# EasyEDA Pro project md2.PcbDoc-V1.0-20250619.eprj

# Board md2.PcbDoc-V1.0-20250619
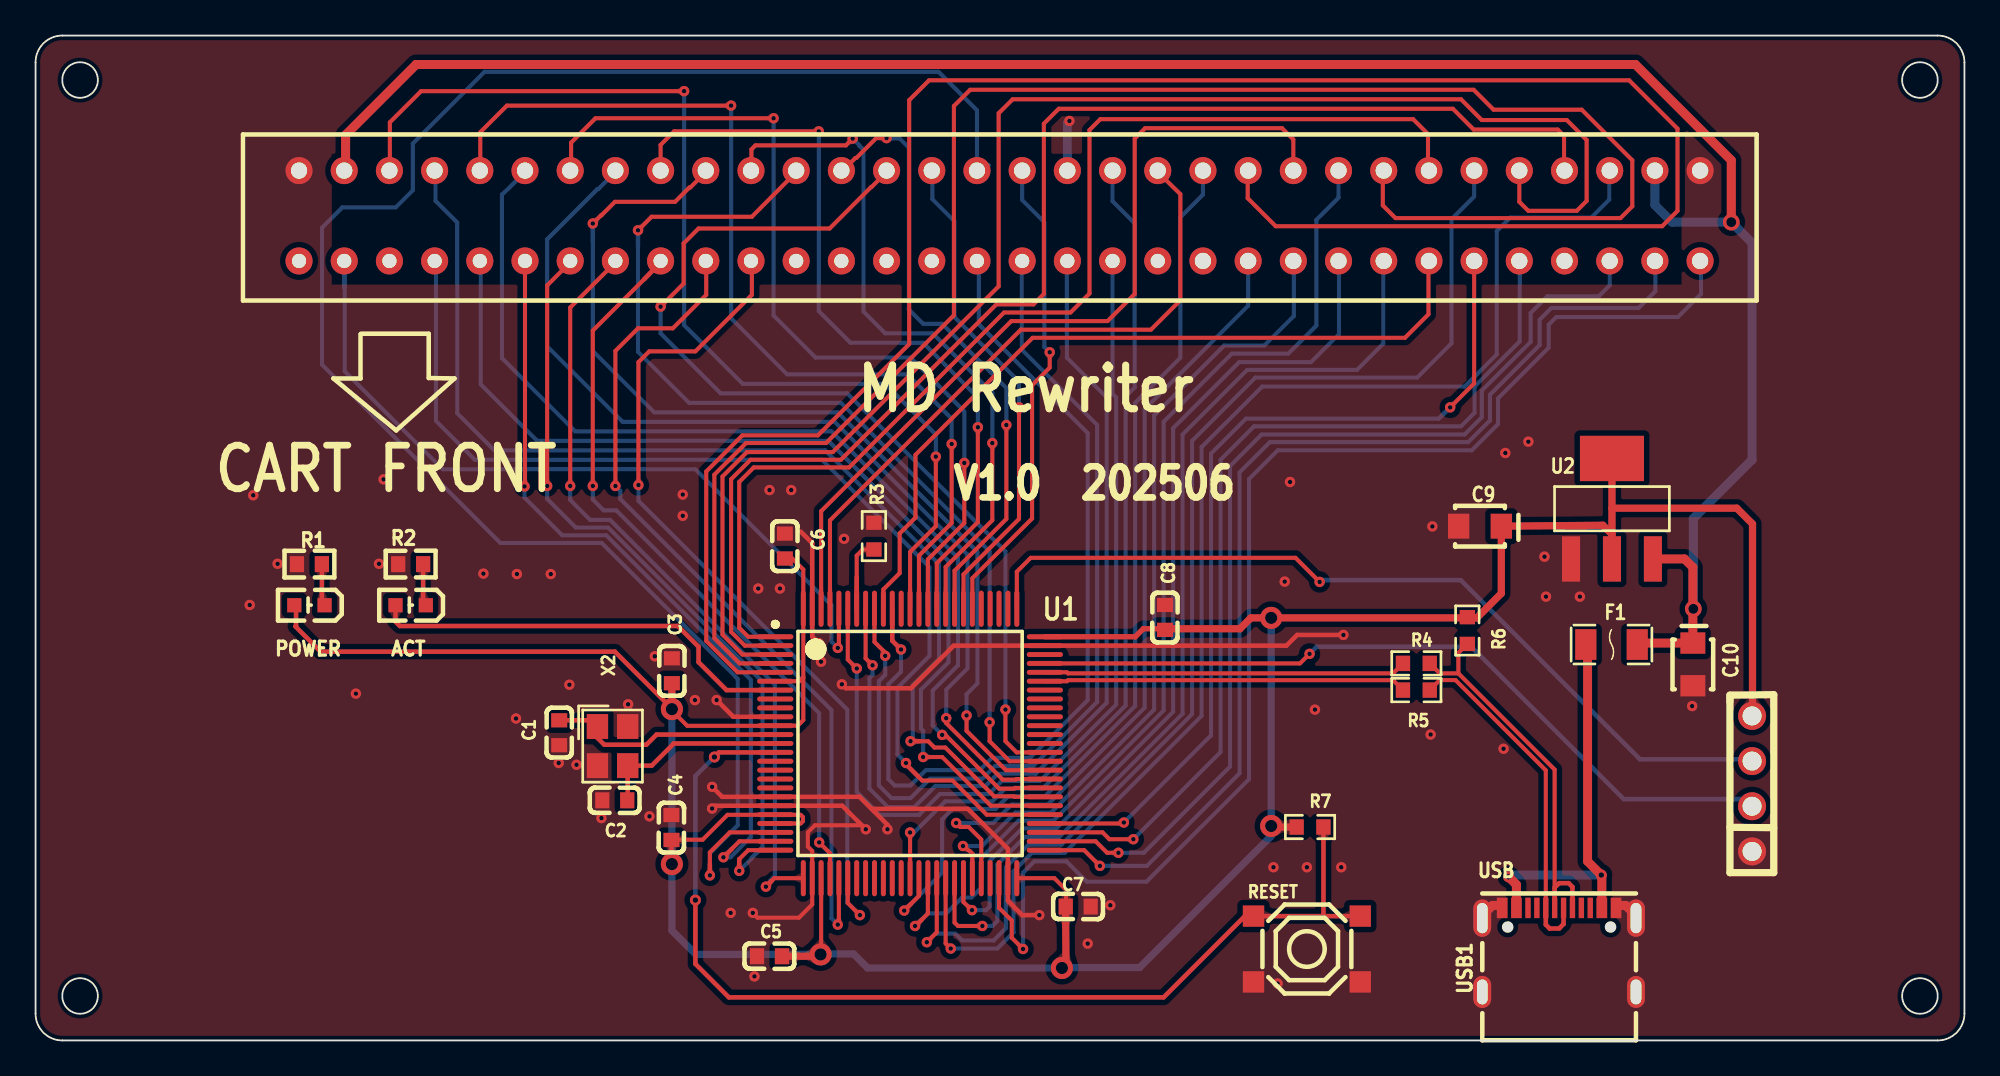
[diagram p0: board, top side]
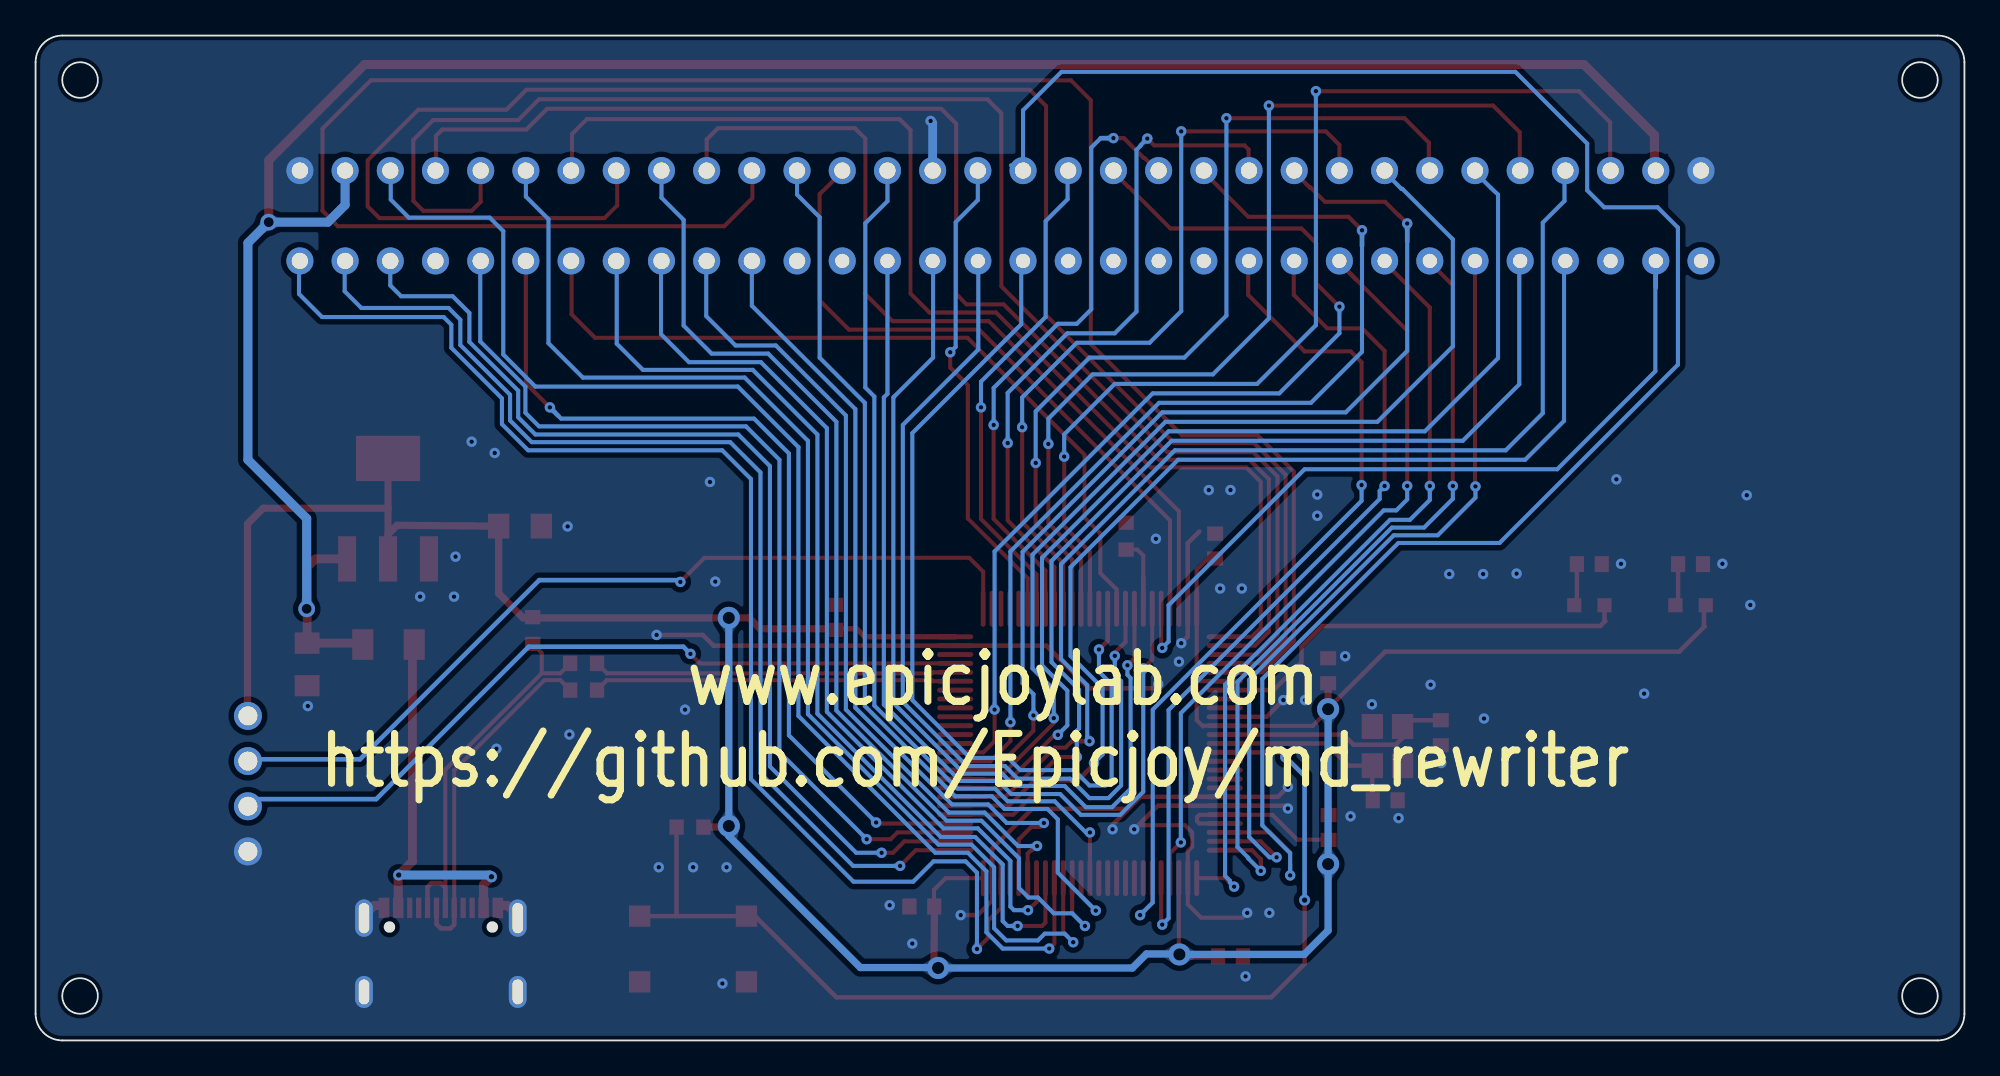
[diagram p1: board, bottom side, seen from below]

Outline 108.4 x 56.5 mm; copper layers: Top Layer, Bottom Layer. Coordinates in mm from the lower left corner of the outline.
Outline path: circle c2.5,54 r1 ; circle c2.5,2.5 r1 ; circle c105.9,54 r1 ; circle c105.9,2.5 r1 ; 0,55 0,1.5 arc(0.44,0.44) 1.5,0 106.9,0 arc(107.96,0.44) 108.4,1.5 108.4,55 arc(107.96,56.06) 106.9,56.5 1.5,56.5 arc(0.44,56.06) 0,55
Stack: Top Layer 0.035mm / Dielectric1 1.51mm FR4 er 4.5 / Bottom Layer 0.035mm

## Design rules (mm)
net USB1_A6: DP3
net USB1_A7: DP3
net S$187738: DP1
net S$187734: DP1
template: 用户自定义配置
spacing Default (default): track to track 0.152, other pairs 0 to 0.152
track width Default (default): min 0.152, default 0.152, max 25.4
differential pair differentialPair (default): width min 0.127, default 0.254, max 2.54; gap min 0.152, default 0.152
via Default (default): diameter min 0.457, default 0.457, max 100.025; hole min 0.254, default 0.254, max 59.995
pour e430 uses gge161012
pour e1071 uses gge161012(1)

## Placement (name value [footprint] x y rotation side)
ACT  R  [LED0603-R-RD]  21.08 24.47 180 top
C1  22PF  [C0603]  29.43 17.3 270 top
C2  22PF  [C0603]  32.55 13.5 0 top
C3  0.1UF  [C0603]  35.76 20.79 90 top
C4  0.1UF  [C0603]  35.73 11.97 90 top
C5  0.1UF  [C0603]  41.25 4.73 0 top
C6  0.1UF  [C0603]  42.11 27.8 90 top
C7  0.1UF  [C0603]  58.59 7.53 0 top
C8  0.1UF  [C0603]  63.47 23.78 90 top
C9  C9  [CAP-CASE-A_3216]  81.18 28.91 180 top
C10  C10  [CAP-CASE-A_3216]  93.14 21.14 270 top
F1  -  [F1206]  88.57 22.26 180 top
NOREF  -  [Pad_e1796]  96.47 13.17 270 top
NOREF#2  -  [Pad_e1795]  96.47 15.71 270 top
NOREF#3  -  [Pad_e1797]  96.47 10.63 270 top
NOREF#4  -  [Pad_e1794]  96.47 18.25 270 top
P2  -  [S-64M-2.54]  14.81 48.91 90 top
POWER  R  [LED0603-R-RD]  15.39 24.47 180 top
R1  220  [R0603]  15.39 26.78 0 top
R2  220  [R0603]  21.08 26.78 0 top
R3  -  [R0603#2]  47.11 28.36 90 top
R4  -  [R0603#2]  77.6 21.2 0 top
R5  -  [R0603#2]  77.6 19.7 0 top
R6  -  [R0603#2]  80.46 23.05 90 top
R7  -  [R0603#2]  71.62 12 180 top
RESET  -  [KEY-SMD_4P-L5.1-W5.1-P3.70-LS6.5]  71.45 5.14 180 top
U1  -  [STM32F103VET6-LQFP]  49.15 16.7 0 top
U11  -  [AMS1117]  88.59 29.9 90 top
USB1  TYPE-C16PIN  [USB-C-SMD_TYPE-C16PIN]  85.62 5.09 0 top
X2  8MHz  [CRYSTAL-SMD_4P-L3.2-W2.5-BL]  32.43 16.55 270 top

## Footprints (pads in the part's own frame, mm; a bottom-side part is the same pattern mirrored in y, then rotated)
AMS1117
  rect 2.55x1.015 smd: 1(-2.825,2.3) 2(-2.825,0) 3(-2.825,-2.3)
  rect 2.55x3.6 smd: 4(2.825,0)
C0603
  rect 0.8x0.9 smd: 1(-0.7,0) 2(0.7,0)
CAP-CASE-A_3216
  rect 1.2x1.4 smd: 1(-1.2,0) 2(1.2,0)
CRYSTAL-SMD_4P-L3.2-W2.5-BL
  rect 1.4x1.2 smd: 1(-1.1,-0.85) 2(1.1,-0.85) 3(1.1,0.85) 4(-1.1,0.85)
F1206
  rect 1.19x1.728 smd: 1(-1.445,0) 2(1.445,0)
KEY-SMD_4P-L5.1-W5.1-P3.70-LS6.5
  rect 1.2x1.2 smd: 1(-3,1.85) 2(3,1.85) 3(-3,-1.85) 4(3,-1.85)
LED0603-R-RD
  rect 0.8x0.8 smd: 1(0.851,0) 2(-0.851,0)
Pad_e1794
  round 1.575 hole 1.067: 1(0,0)
Pad_e1795
  round 1.575 hole 1.067: 1(0,0)
Pad_e1796
  round 1.575 hole 1.067: 1(0,0)
Pad_e1797
  round 1.575 hole 1.067: 1(0,0)
R0603
  rect 0.8x0.9 smd: 1(-0.7,0) 2(0.7,0)
R0603#2
  rect 0.806x0.864 smd: 1(-0.753,0) 2(0.753,0)
S-64M-2.54
  round 1.524 hole 0.8: 1(-5.08,0) 2(-5.08,-2.54) 3(-5.08,-5.08) 4(-5.08,-7.62) 5(-5.08,-10.16) 6(-5.08,-12.7) 7(-5.08,-15.24) 8(-5.08,-17.78) 9(-5.08,-20.32) 10(-5.08,-22.86) 11(-5.08,-25.4) 12(-5.08,-27.94) 13(-5.08,-30.48) 14(-5.08,-33.02) 15(-5.08,-35.56) 16(-5.08,-38.1) 17(-5.08,-40.64) 18(-5.08,-43.18) 19(-5.08,-45.72) 20(-5.08,-48.26)
  round 1.524 hole 0.914: 21(-5.08,-50.8) 22(-5.08,-53.34) 23(-5.08,-55.88) 24(-5.08,-58.42) 25(-5.08,-60.96) 26(-5.08,-63.5) 27(-5.08,-66.04) 28(-5.08,-68.58) 29(-5.08,-71.12) 30(-5.08,-73.66) 31(-5.08,-76.2) 32(-5.08,-78.74) 33(0,-78.74) 34(0,-76.2) 35(0,-73.66) 36(0,-71.12) 37(0,-68.58) 38(0,-66.04) 39(0,-63.5) 40(0,-60.96) 41(0,-58.42) 42(0,-55.88) 43(0,-53.34) 44(0,-50.8) 45(0,-48.26) 46(0,-45.72) 47(0,-43.18) 48(0,-40.64) 49(0,-38.1) 50(0,-35.56) 51(0,-33.02) 52(0,-30.48) 53(0,-27.94) 54(0,-25.4) 55(0,-22.86) 56(0,-20.32) 57(0,-17.78) 58(0,-15.24) 59(0,-12.7) 60(0,-10.16) 61(0,-7.62) 62(0,-5.08) 63(0,-2.54) 64(0,0)
STM32F103VET6-LQFP
  oval 2.032x0.28 smd: 1(-7.575,6) 2(-7.575,5.5) 3(-7.575,5) 4(-7.575,4.5) 5(-7.575,4) 6(-7.575,3.5) 7(-7.575,3) 8(-7.575,2.5) 9(-7.575,2) 10(-7.575,1.5) 11(-7.575,1) 12(-7.575,0.5) 13(-7.575,0) 14(-7.575,-0.5) 15(-7.575,-1) 16(-7.575,-1.5) 17(-7.575,-2) 18(-7.575,-2.5) 19(-7.575,-3) 20(-7.575,-3.5) 21(-7.575,-4) 22(-7.575,-4.5) 23(-7.575,-5) 24(-7.575,-5.5) 25(-7.575,-6) 51(7.575,-6) 52(7.575,-5.5) 53(7.575,-5) 54(7.575,-4.5) 55(7.575,-4) 56(7.575,-3.5) 57(7.575,-3) 58(7.575,-2.5) 59(7.575,-2) 60(7.575,-1.5) 61(7.575,-1) 62(7.575,-0.5) 63(7.575,0) 64(7.575,0.5) 65(7.575,1) 66(7.575,1.5) 67(7.575,2) 68(7.575,2.5) 69(7.575,3) 70(7.575,3.5) 71(7.575,4) 72(7.575,4.5) 73(7.575,5) 74(7.575,5.5) 75(7.575,6)
  oval 0.28x2.032 smd: 26(-6,-7.575) 27(-5.5,-7.575) 28(-5,-7.575) 29(-4.5,-7.575) 30(-4,-7.575) 31(-3.5,-7.575) 32(-3,-7.575) 33(-2.5,-7.575) 34(-2,-7.575) 35(-1.5,-7.575) 36(-1,-7.575) 37(-0.5,-7.575) 38(0,-7.575) 39(0.5,-7.575) 40(1,-7.575) 41(1.5,-7.575) 42(2,-7.575) 43(2.5,-7.575) 44(3,-7.575) 45(3.5,-7.575) 46(4,-7.575) 47(4.5,-7.575) 48(5,-7.575) 49(5.5,-7.575) 50(6,-7.575) 76(6,7.575) 77(5.5,7.575) 78(5,7.575) 79(4.5,7.575) 80(4,7.575) 81(3.5,7.575) 82(3,7.575) 83(2.5,7.575) 84(2,7.575) 85(1.5,7.575) 86(1,7.575) 87(0.5,7.575) 88(0,7.575) 89(-0.5,7.575) 90(-1,7.575) 91(-1.5,7.575) 92(-2,7.575) 93(-2.5,7.575) 94(-3,7.575) 95(-3.5,7.575) 96(-4,7.575) 97(-4.5,7.575) 98(-5,7.575) 99(-5.5,7.575) 100(-6,7.575)
USB-C-SMD_TYPE-C16PIN
  oval 1x2.1 hole 0.6x1.7: 1(-4.32,1.788) 2(4.32,1.788)
  oval 1x1.8 hole 0.6x1.4: 3(-4.32,-2.362) 4(4.32,-2.362)
  rect 0.6x1.15 smd: A1B12(-3.2,2.362) A4B9(-2.4,2.362) B1A12(3.2,2.362) B4A9(2.4,2.362)
  rect 0.3x1.15 smd: A5(-1.25,2.362) A6(-0.25,2.362) A7(0.25,2.362) A8(-1.75,2.362) B5(1.75,2.362) B6(0.75,2.362) B7(-0.75,2.362) B8(1.25,2.362)

## Nets
3V3: C3.1 C4.1 C5.2 C6.1 C7.1 C8.1 C9.1 NOREF#4.1 POWER.1 R6.2 R7.2 U1.6 U1.11 U1.21 U1.22 U1.28 U1.50 U1.75 U1.100 U11.2 U11.4
5VOUT: C10.1 F1.1 P2.34 P2.63 U11.3
GND: C1.2 C2.1 C3.2 C4.2 C5.1 C6.2 C7.2 C8.2 C9.2 C10.2 NOREF#3.1 P2.33 P2.47 P2.64 R1.1 R2.1 R3.2 RESET.1 RESET.2 U1.10 U1.19 U1.20 U1.27 U1.49 U1.74 U1.99 U11.1 USB1.1 USB1.2 USB1.3 USB1.4 USB1.A1B12 USB1.B1A12 X2.2 X2.4
/CART: P2.32 U1.48
/MRES: P2.2 U1.96
A1: P2.48 U1.81
A2: P2.50 U1.82
A3: P2.52 U1.83
A4: P2.54 U1.84
A5: P2.56 U1.85
A6: P2.58 U1.86
A7: P2.60 U1.87
A8: P2.62 U1.88
A9: P2.4 U1.55
A10: P2.5 U1.56
A11: P2.61 U1.57
A12: P2.59 U1.58
A13: P2.57 U1.59
A14: P2.55 U1.60
A15: P2.53 U1.61
A16: P2.51 U1.62
A17: P2.49 U1.23
A18: P2.6 U1.24
A19: P2.7 U1.25
A20: P2.8 U1.26
A21: P2.9 U1.29
A22: P2.10 U1.30
A23: P2.11 U1.31
AS: P2.18 U1.93
ASEL: P2.26 U1.91
BOOT0: R3.1 U1.94
CAS0: P2.16 U1.90
CAS2: P2.21
CE_0: P2.17 U1.92
D0: P2.45 U1.97
D1: P2.42 U1.98
D2: P2.39 U1.1
D3: P2.36 U1.2
D4: P2.37 U1.3
D5: P2.40 U1.4
D6: P2.43 U1.5
D7: P2.46 U1.38
D8: P2.44 U1.39
D9: P2.41 U1.40
D10: P2.38 U1.41
D11: P2.35 U1.42
D12: P2.25 U1.43
D13: P2.24 U1.44
D14: P2.23 U1.45
D15: P2.22 U1.46
DTACK: P2.20
EDCLK: P2.15
HSYNC: P2.14
JTAG12: NOREF#2.1 U1.76
JTAG14: NOREF.1 U1.72
LED1_1: POWER.2 R1.2
LED1_2: ACT.2 R2.2
LWR: P2.28 U1.53
M3: P2.30 U1.52
NRST: R7.1 RESET.3 RESET.4 U1.14
S$187162: ACT.1 U1.7
S$187734: R4.1 U1.71
S$187738: R5.1 U1.70
SR1: P2.3
TIME: P2.31 U1.51
USB1_A6: R4.2 R6.1 USB1.A6 USB1.B6
USB1_A7: R5.2 USB1.A7 USB1.B7
UWR: P2.29
VCLK: P2.19 U1.95
VRES: P2.27 U1.54
VSYNC: P2.13
VUSB: F1.2 USB1.A4B9 USB1.B4A9
XTAL+: C2.2 U1.13 X2.3
XTAL-: C1.1 U1.12 X2.1
YS: P2.12

Pads without a net: P2 1; U1 8 9 15 16 17 18 32 33 34 35 36 37 47 63 64 65 66 67 68 69 73 77 78 79 80 89; USB1 A5 A8 B5 B8

## Via types
v1: diameter 0.584, hole 0.254, Top Layer to Bottom Layer, 117 vias
v2: diameter 0.94, hole 0.559, Top Layer to Bottom Layer, 2 vias
v3: diameter 1.244, hole 0.686, Top Layer to Bottom Layer, 6 vias
v4: diameter 0.62, hole 0.31, Top Layer to Bottom Layer, 4 vias

## Routing (per net, layer and track width the routed paths; a pad name or vN(x,y) marks a point on that pad's centre or on a via; arc(x,y) is an arc through that point)
3V3: length 200.6
  Top Layer w0.229: 41.57,20.2 42.93,20.2 43.15,20.42 ; 57.91,6.08 57.91,8.47 57.25,9.12 55.15,9.12 ; 41.65,17.69 36.62,17.69 35.76,18.55 ; 43.15,20.42 43.15,18.01 42.8,17.66 42.76,17.7 41.57,17.7 ; 43.15,20.42 U1.100 43.15,26.48 42.53,27.1 C6.1 ; 41.57,12.2 42.99,12.2 43.13,12.33 43.13,12.55 43,12.68 38.88,12.68 37.49,11.29 35.71,11.29 ; 44.15,4.84 44.15,9.12
  Top Layer w0.254: v3(35.76,9.92) 35.73,9.94 C4.1 ; U11.2 88.59,29.92 ; POWER.1 14.64,24.37 14.64,23.32 14.6,23.28 16.02,21.86 32.56,21.86 35.56,18.86 35.76,18.86
  Top Layer w0.3: 56.72,22.7 61.8,22.7 62.25,23.15 63.55,23.15
  Top Layer w0.406: 88.59,29.92 95.61,29.92 96.49,29.04 96.49,18.27 NOREF#4.1 ; 88.59,29.92 U11.4 ; 88.59,29.92 88.59,28.46 ; 35.76,20.2 v3(35.76,18.63) ; 57.88,7.58 57.91,4.3 v3(57.68,4.07) ; 70.87,12 69.5,12 69.44,12.06 ; 63.55,23.15 67.69,23.15 68.3,23.76 81,23.76 82.37,25.14 82.37,28.91 88.08,28.97 88.59,28.46 ; 88.59,28.46 88.59,26.78 ; 41.88,4.73 44.02,4.73 v3(44.12,4.84)
  Bottom Layer w0.406: v3(69.44,23.76) v3(69.44,12.06) 69.44,11.49 62.05,4.1 57.71,4.1 v3(57.68,4.07) 46.76,4.07 45.97,4.86 44.14,4.86 v3(44.12,4.84) 37.11,4.84 35.76,6.18 v3(35.76,18.63)
5VOUT: length 127.5
  Top Layer w0.5: 93.06,22.26 93.14,22.34 ; F1.1 90.09,22.34 C10.1 93.14,26.6 92.67,27.07 U11.3
  Top Layer w0.508: 17.35,48.83 17.42,48.9 17.42,50.91 21.38,54.87 89.91,54.87 95.3,49.49 v2(95.3,46.01)
  Bottom Layer w0.508: v2(93.16,24.27) 93.16,29.35 96.47,32.65 96.47,44.84 v2(95.3,46.01) 91.97,46.01 91.01,46.97 91.01,48.83
GND: length 90.7
  Top Layer w0.229: v1(40.31,7.17) 40.58,6.9 42.9,6.9 43.65,7.65 U1.27 43.65,10.65 43.4,10.9 43.4,11.7 43.8,12.1 46.43,12.1
  Top Layer w0.254: v1(73.5,22.8) 70.9,22.8 70.3,22.2 51.6,22.2 49.2,19.8 45.54,19.8 v1(45.31,20.02) ; v1(38.28,19.14) 39.21,18.2 41.57,18.2 ; v1(38.02,13.04) 38.18,13.2 45.33,13.2 46.43,12.1 v1(46.66,11.87) ; 47.2,12.85 47.18,12.85 47,13.02 52.39,13.02 53.19,12.22 53.2,12.22 54.65,10.78 U1.49 54.65,7.85 55.45,7.05 v1(56.41,7.05) ; 43,28.61 43.65,27.96 43.65,22.7 v1(44.02,22.34) ; v1(47.88,11.87) 47.88,12.12 46.3,13.7 U1.19 38.58,13.7 v1(38.02,14.26)
  Top Layer w0.508: 88.82,7.59 89.37,7.59 89.94,7.01 ; 82.42,7.59 81.88,7.59 81.3,7.01
  Bottom Layer w0.5: P2.47 57.99,51.59 v1(58.1,51.7)
  vias: v1(12.03,24.48) v1(12.23,30.65) v1(13.6,26.8) v1(18,19.5) v1(19.3,26.8) v1(19.56,31.55) v1(25.17,26.25) v1(27,18.1) v1(27.05,26.22) v1(28.95,26.22) v1(29.4,15.6) v1(30,20) v1(30.4,15.5) v1(31.8,12.5) v1(33.3,18.9) v1(34.5,12.6) v1(34.8,21.6) v1(36.37,30.69) v1(36.37,29.5) v1(37.06,19.14) v1(39.06,7.17) v1(40.4,3.6) v1(40.61,25.41) v1(41.25,30.95) v1(41.83,25.41) v1(42.47,30.95) v1(44.14,21.29) v1(45.44,28.2) v1(59.13,5.45) v1(60.4,7.6) v1(69.57,9.74) v1(69.8,3.2) v1(70.2,25.8) v1(70.5,31.4) v1(71.45,9.74) v1(71.9,18.6) v1(73.38,9.74) v1(78.4,17.2) v1(78.5,28.9) v1(82.5,16.4) v1(82.6,33.03) v1(83.89,33.66) v1(84.8,27.2) v1(84.88,24.95) v1(86.79,24.95) v1(93.1,18.8)
/CART: length 74.7
  Top Layer w0.229: 54.15,9.12 54.15,7.45 54.86,6.74 54.86,5.78 v1(55.5,5.14)
  Bottom Layer w0.229: 93.55,43.75 93.6,43.7 93.6,41.97 92.3,40.68 85.47,40.68 85.04,40.24 85.04,38.95 82.19,36.1 82.19,34.66 80.72,33.18 69.81,33.18 68.2,31.57 68.2,14.69 62.43,8.93 59.08,8.93 57.93,10.07 56.13,10.07 55.5,9.43 v1(55.5,5.14)
/MRES: length 45.2
  Top Layer w0.229: v1(45.08,22.07) 45.15,22.13 45.15,24.27
  Bottom Layer w0.229: 17.37,43.8 17.37,37.63 22.88,32.12 37.08,32.12 44.73,24.47 44.73,22.43 v1(45.08,22.07)
  Bottom Layer w0.254: 17.35,43.75 17.35,42.32
A1: length 27.1
  Top Layer w0.229: v1(56.99,38.69) 56.99,37.83 56,36.84 56,29.35 52.65,25.99 52.65,24.27
  Bottom Layer w0.229: P2.48 55.45,47.25 56.69,46.01 56.69,39 v1(56.99,38.69)
A2: length 28
  Top Layer w0.229: v1(55.27,35.6) 55.27,29.32 52.15,26.2 52.15,24.27
  Bottom Layer w0.229: P2.50 50.4,48.87 50.4,47.3 51.64,46.06 51.64,40.68 55.27,37.04 v1(55.27,35.6)
A3: length 35.5
  Top Layer w0.229: 45.29,48.83 46.07,49.62 46.13,49.62 47.24,50.73 v1(47.83,50.73) ; v1(54.56,34.6) 54.56,29.32 51.65,26.41 51.65,24.27
  Bottom Layer w0.229: v1(54.56,34.6) 54.56,36.69 50.95,40.29 49.88,40.29 49.07,41.11 49.07,50.2 48.54,50.73 v1(47.83,50.73)
  Bottom Layer w0.254: 48.54,50.73 v1(47.83,50.73)
A4: length 39.6
  Top Layer w0.229: 40.21,48.83 40.23,48.85 40.23,50.1 40.46,50.33 45.54,50.33 v1(45.92,50.71) ; 51.15,24.27 51.15,26.62 53.77,29.25 v1(53.77,33.59)
  Bottom Layer w0.229: v1(45.92,50.71) 46.29,50.33 46.29,50.31 46.53,50.07 46.53,40.98 47.75,39.76 50.42,39.76 53.77,36.41 v1(53.77,33.59)
A5: length 44.6
  Top Layer w0.229: 50.65,24.27 50.65,26.83 52.96,29.14 v1(52.96,34.48) ; v1(44.02,51.11) 35.89,51.11 35.13,50.35 35.13,48.83
  Bottom Layer w0.229: v1(52.96,34.48) 52.96,36.15 49.88,39.23 45.79,39.23 44.02,41.01 v1(44.02,51.11)
A6: length 49.6
  Top Layer w0.229: 30.05,48.83 30.1,48.88 30.1,50.48 31.47,51.85 v1(41.48,51.85) ; v1(52.19,32.47) 52.19,29.09 50.15,27.05 50.15,24.27
  Bottom Layer w0.229: v1(52.19,32.47) 52.19,35.37 49.17,38.39 43.84,38.39 41.48,40.76 v1(41.48,51.85)
A7: length 55.1
  Top Layer w0.229: 49.65,24.27 49.65,27.26 51.48,29.09 v1(51.48,33.54) ; 24.97,48.83 24.99,48.85 24.99,51.06 26.49,52.56 v1(39.09,52.56)
  Bottom Layer w0.229: v1(51.48,33.54) 51.48,34.96 48.99,37.45 42.24,37.45 39.09,40.6 v1(39.09,52.56)
A8: length 60.3
  Top Layer w0.229: v1(50.59,32.83) 50.59,28.91 49.15,27.47 49.15,24.27 ; v1(36.45,53.38) 21.66,53.38 19.91,51.62 19.91,48.85 19.89,48.83
  Bottom Layer w0.229: v1(50.59,32.83) 50.59,34.07 47.75,36.92 39.75,36.92 36.45,40.22 v1(36.45,53.38)
A9: length 61.1
  Top Layer w0.229: U1.55 56.71,12.69 53.46,12.69 51.53,14.61 49.83,14.61 49.58,14.86
  Top Layer w0.254: v1(48.92,15.6) 48.92,15.52 49.58,14.86
  Bottom Layer w0.229: 22.43,43.75 22.5,43.67 22.5,34.83 24.69,32.65 44.19,32.65 50.24,26.6 50.24,21.63 48.44,19.82 48.44,16.08 v1(48.92,15.6)
A10: length 57
  Top Layer w0.229: 56.72,13.2 53.69,13.2 50.95,15.94 v1(49.88,15.94)
  Bottom Layer w0.229: 24.97,43.75 25.02,43.7 25.02,36.89 28.19,33.72 44.55,33.72 51.31,26.96 51.31,21.27 49.76,19.72 49.76,17.54 49.88,17.41 v1(49.88,15.94)
A11: length 64.7
  Top Layer w0.229: U1.57 55.02,13.7 54.99,13.73 53.87,13.73 51.13,16.47 50.52,16.47 50.16,16.82 v1(49.17,16.82)
  Top Layer w0.254: v1(49.17,16.82) 49.69,16.82
  Bottom Layer w0.229: 22.43,48.83 22.48,48.78 22.48,47.2 23.7,45.98 23.7,35.26 25.78,33.18 44.37,33.18 50.77,26.78 50.77,21.45 49.3,19.97 49.3,16.95 v1(49.17,16.82)
A12: length 59.1
  Top Layer w0.229: U1.58 55.04,14.2 55,14.16 54.15,14.16 51.13,17.18 v1(50.95,17.18)
  Bottom Layer w0.229: v1(50.95,17.18) 50.42,17.71 50.42,19.67 51.84,21.09 51.84,27.14 44.73,34.25 30.32,34.25 26.21,38.36 26.21,47.56 26.61,47.93 27.51,48.83
A13: length 56.7
  Top Layer w0.229: U1.59 55.12,14.7 55.09,14.67 54.35,14.67 51.18,17.84 v1(51.18,18.12)
  Bottom Layer w0.229: v1(51.18,18.12) 51.18,19.72 52.37,20.91 52.37,27.31 44.9,34.78 32.99,34.78 28.75,39.02 28.75,45.04 31.58,47.88 31.64,47.88 32.59,48.83
A14: length 57.7
  Top Layer w0.229: v1(52.32,18.27) 52.32,17.41 54.53,15.2 56.72,15.2 ; v1(31.32,45.93) 31.77,46.39 31.8,46.39 32.56,47.15 35.94,47.15 36.75,47.96 36.8,47.96 37.67,48.83
  Bottom Layer w0.229: v1(31.32,45.93) 31.32,38.77 34.77,35.32 45.08,35.32 52.93,27.47 52.93,20.08 52.32,19.47 v1(52.32,18.27)
  Bottom Layer w0.254: v1(31.32,45.93) 31.32,44.9
A15: length 56.6
  Top Layer w0.229: v1(33.86,45.55) 34.62,46.31 40.26,46.31 42.75,48.83 ; 56.72,15.7 54.74,15.7 53.62,16.82 v1(53.62,17.89)
  Bottom Layer w0.229: v1(53.62,17.89) 53.62,27.49 45.26,35.85 36.73,35.85 33.86,38.72 v1(33.86,45.55)
  Bottom Layer w0.254: v1(33.86,45.55) 33.86,44.66
A16: length 56.3
  Top Layer w0.229: v1(54.51,18.6) 54.51,16.82 55.13,16.2 56.72,16.2 ; v1(35.13,41.26) 36.42,42.55 36.42,44.82 37.26,45.65 44.62,45.65 46.96,47.99 46.98,47.99 47.83,48.83
  Bottom Layer w0.229: v1(35.13,41.26) 35.13,39.76 38.5,36.38 45.62,36.38 54.51,27.49 v1(54.51,18.6)
A17: length 102.6
  Top Layer w0.229: 37.89,9.89 37.89,10.58 39.01,11.7 41.57,11.7
  Top Layer w0.254: v1(37.89,9.28) 37.89,9.89
  Bottom Layer w0.229: v1(37.89,9.28) 37.89,10.53 39.46,12.1 39.46,20.32 31.81,27.97 26.12,27.97 16.1,38 16.1,45.7 17.24,46.84 20.24,46.84 21.2,47.8 21.2,50.43 25.23,54.46 50.74,54.46 52.91,52.3 P2.49 ; 53.58,49.2 53.21,48.83 52.91,48.83
A18: length 44.3
  Top Layer w0.229: 27.51,43.75 27.51,31.18 v1(27.48,31.15) ; 39.12,10.76 39.56,11.2 41.57,11.2
  Top Layer w0.254: v1(38.66,10.3) 39.12,10.76
  Bottom Layer w0.229: v1(27.48,31.15) 27.48,30.52 29.6,28.4 32.07,28.4 40.2,20.28 40.2,11.44 39.06,10.3 v1(38.66,10.3)
A19: length 44.3
  Top Layer w0.229: 30.05,43.75 28.75,42.45 v1(28.75,31.18) ; 39.54,10.2 40.05,10.7 41.57,10.7
  Top Layer w0.254: v1(39.54,9.53) 39.54,10.2
  Bottom Layer w0.229: v1(39.54,9.53) 40.25,10.23 40.25,10.27 40.85,10.88 40.85,20.16 32.17,28.84 30.36,28.84 28.75,30.45 v1(28.75,31.18)
A20: length 44.6
  Top Layer w0.229: U1.26 41.52,9.12 v1(41.04,8.65) ; v1(30.05,31.18) 30.05,41.21 32.59,43.75
  Top Layer w0.254: v1(41.04,8.65) 41.37,8.97
  Bottom Layer w0.229: v1(30.05,31.18) 30.05,30.39 31.16,29.27 32.28,29.27 41.55,20 41.55,9.26 41.28,8.99 41.28,8.88 v1(41.04,8.65)
A21: length 43.5
  Top Layer w0.229: 44.65,9.12 44.65,10.53 v1(44.04,11.13) ; 35.15,43.75 31.32,39.91 v1(31.32,31.18)
  Top Layer w0.254: 34.19,42.79 35.13,43.75
  Bottom Layer w0.229: v1(44.04,11.13) 44.04,18.4 32.64,29.8 31.92,29.8 31.32,30.41 v1(31.32,31.18)
A22: length 48.3
  Top Layer w0.229: 45.15,9.12 45.15,6.75 45.08,6.69 v1(45.08,6.51) ; 37.67,43.75 37.69,43.72 37.69,41.92 35.81,40.04 33.86,40.04 32.59,38.77 v1(32.59,31.18)
  Bottom Layer w0.229: v1(45.08,6.51) 44.73,6.87 44.73,18.58 32.86,30.44 32.86,30.9 v1(32.59,31.18)
A23: length 48.4
  Top Layer w0.229: 40.21,43.75 40.26,43.7 40.26,41.92 37.08,38.74 34.49,38.74 33.88,38.14 v1(33.88,31.23) ; v1(46.33,7.05) 45.65,7.73 U1.31
  Bottom Layer w0.229: v1(33.88,31.23) 33.88,30.34 45.62,18.6 45.62,7.76 46.33,7.05
AS: length 52.2
  Top Layer w0.229: v1(47.04,21.09) 46.65,21.48 46.65,24.27
  Bottom Layer w0.229: v1(47.04,21.09) 47.04,20.56 46.86,20.38 46.86,14.16 47.9,13.12 49.37,13.12 50.57,14.31 53.39,14.31 54.07,15 56.21,15 60.19,18.98 60.19,36.15 60.14,36.2 60.14,36.21 57.96,38.39 57.96,43.72 57.99,43.75
ASEL: length 44.4
  Top Layer w0.229: 47.65,24.27 47.65,25.36 48.56,26.27 48.56,28.51 49.45,29.4 49.45,32.93 56.03,39.51 76.96,39.51 78.28,40.83 78.28,43.72 78.31,43.75
BOOT0: length 5.9
  Top Layer w0.229: 46.15,24.27 46.15,27.26 46.49,27.6 R3.1
  Top Layer w0.254: 46.15,24.27 46.15,26.04
CAS0: length 50.6
  Top Layer w0.254: v1(48.64,21.98) 48.15,22.47 48.15,24.27
  Bottom Layer w0.229: 52.91,43.75 53.01,43.65 53.01,40.27 59.13,34.15 59.13,19.14 55.88,15.88 53.74,15.88 53.06,15.2 50.03,15.2 49.17,14.34 48.28,14.34 47.93,14.69 47.93,20.02 48.64,20.74 v1(48.64,21.98)
CE_0: length 51.6
  Top Layer w0.229: 47.15,24.27 47.15,22.4 47.75,21.8 v1(47.75,21.63)
  Bottom Layer w0.229: v1(47.75,21.63) 47.75,20.56 47.39,20.2 47.39,14.34 48.1,13.62 49.17,13.62 50.26,14.72 53.21,14.72 53.92,15.43 56.06,15.43 59.66,19.03 59.66,34.6 55.42,38.85 55.42,43.72 55.45,43.75
D0: length 37.5
  Top Layer w0.229: 44.65,24.27 44.65,29.24 55.37,39.96 62.68,39.96 64.34,41.61 64.34,47.58 63.07,48.83
D1: length 48.2
  Top Layer w0.229: 44.15,24.27 44.15,29.76 54.84,40.45 60.25,40.45 61.77,41.97 61.77,50.71 62.35,51.29 70.05,51.29 70.69,50.66 70.69,48.83
D2: length 65.5
  Top Layer w0.229: 78.31,48.83 78.25,48.88 78.25,50.96 77.42,51.8 59.84,51.8 59.23,51.19 59.23,42 58.16,40.93 54.43,40.93 45.72,32.22 40.36,32.22 39.54,31.4 39.54,23.2 40.05,22.7 41.57,22.7
D3: length 75.1
  Top Layer w0.229: 41.57,22.2 39.86,22.2 39.09,22.97 39.09,31.56 40.18,32.65 45.26,32.65 54,41.39 56.08,41.39 56.66,41.97 56.66,51.55 57.5,52.38 79.65,52.38 80.82,51.22 85.54,51.22 85.9,50.86 85.9,48.85 85.93,48.83
D4: length 85.6
  Top Layer w0.229: 41.57,21.7 39.73,21.7 38.6,22.82 38.6,31.71 39.98,33.08 44.8,33.08 54.12,42.4 54.12,52.13 54.91,52.92 80.11,52.92 81.28,51.75 86.05,51.75 87.17,50.63 87.17,47.2 86.61,46.64 83.89,46.64 83.39,47.15 83.39,48.83
D5: length 101.4
  Top Layer w0.229: 75.77,48.83 75.71,48.78 75.71,46.95 76.43,46.24 89.07,46.24 89.74,46.9 89.74,49.49 86.89,52.33 81.94,52.33 80.82,53.45 52.52,53.45 51.61,52.54 51.61,40.78 44.42,33.59 39.93,33.59 38.15,31.81 38.15,22.62 39.56,21.2 41.57,21.2
D6: length 118.3
  Top Layer w0.229: 41.57,20.7 39.46,20.7 37.69,22.46 37.69,31.99 39.72,34.02 43.96,34.02 49.1,39.15 49.1,52.87 50.21,53.98 89.56,53.98 92.28,51.27 92.28,46.64 91.41,45.78 69.69,45.78 68.12,47.36 68.12,48.8 68.15,48.83
D7: length 48.4
  Top Layer w0.229: v1(49.15,11.69) U1.38
  Bottom Layer w0.229: v1(49.15,11.69) 49.37,11.69 51.13,13.45 53.77,13.45 54.48,14.16 56.59,14.16 61.26,18.83 61.26,36.2 61.77,36.71 61.77,45.94 60.53,47.19 P2.46
D8: length 53.3
  Top Layer w0.229: U1.39 49.65,8.13 49.19,7.67
  Top Layer w0.254: v1(48.82,7.3) 49.19,7.67
  Bottom Layer w0.229: P2.44 65.61,47.56 64.34,46.29 64.34,38.39 61.8,35.85 61.8,18.81 56.72,13.73 54.66,13.73 53.95,13.01 51.53,13.01 50.95,12.43 50.95,9.43 v1(48.82,7.3)
D9: length 59.3
  Top Layer w0.229: 49.79,6.78 50.15,7.13 U1.40
  Top Layer w0.254: v1(49.43,6.44) 49.45,6.44 49.79,6.78
  Bottom Layer w0.229: v1(49.43,6.44) 50.14,7.15 51.18,7.15 52.07,8.04 52.6,8.04 53.13,8.57 53.13,10.25 55.24,12.35 57.2,12.35 63.4,18.55 63.4,34.78 67.23,38.62 70.41,38.62 71.98,40.19 71.98,46.14 73.23,47.38 P2.41
D10: length 68.8
  Top Layer w0.229: v1(50.09,5.52) 50.65,6.08 U1.41
  Bottom Layer w0.229: P2.38 80.85,47.45 79.58,46.18 79.58,39.2 77.65,37.27 68.55,37.27 65,33.72 65,18.35 57.66,11.01 55.8,11.01 54.53,9.74 54.53,6.31 53.84,5.62 52.07,5.62 51.69,6 50.57,6 v1(50.09,5.52)
D11: length 75
  Top Layer w0.229: 51.15,9.12 51.15,5.45 v1(51.43,5.17)
  Bottom Layer w0.229: v1(51.43,5.17) 54.05,5.17 54.96,6.08 54.96,9.51 56,10.55 57.83,10.55 65.53,18.25 65.53,33.36 68.93,36.76 80.31,36.76 82.12,38.57 82.12,45.5 82.88,46.26 87.42,46.26 88.44,47.28 88.44,48.8 88.47,48.83
D12: length 55.9
  Top Layer w0.229: v1(53.21,6.44) 51.84,6.44 51.65,6.63 51.65,9.12
  Bottom Layer w0.229: 75.77,43.75 75.74,43.72 75.74,39.18 74.27,37.7 68.09,37.7 64.46,34.07 64.46,18.37 57.53,11.44 55.6,11.44 54.05,9.89 54.05,6.72 53.77,6.44 v1(53.21,6.44)
D13: length 50.9
  Top Layer w0.229: U1.44 52.15,7.78 v1(52.63,7.32)
  Bottom Layer w0.229: 73.23,43.75 73.25,43.72 73.25,39.71 71.68,38.14 67.64,38.14 63.93,34.43 63.93,18.48 57.38,11.92 55.45,11.92 53.62,10.09 53.62,7.53 53.41,7.32 v1(52.63,7.32)
D14: length 45.7
  Top Layer w0.229: U1.45 52.65,10.51 52.5,10.65 52.4,10.7 v1(52.12,10.93)
  Bottom Layer w0.229: 70.69,43.75 70.71,43.72 70.71,40.73 69.06,39.07 66.8,39.07 62.86,35.14 62.86,18.6 57.07,12.81 55.06,12.81 53.18,10.93 v1(52.12,10.93)
D15: length 44.7
  Top Layer w0.229: U1.46 53.15,11.3 52.45,12 51.96,12 v1(51.74,12.23)
  Bottom Layer w0.229: 68.15,43.75 68.15,41.31 62.33,35.49 62.33,18.7 56.89,13.27 54.86,13.27 53.82,12.23 v1(51.74,12.23)
JTAG12: length 48.5
  Top Layer w0.229: 55.15,24.27 55.15,26.35 55.93,27.14 70.81,27.14 v1(72.16,25.78)
  Bottom Layer w0.254: NOREF#2.1 96.37,15.81 90.17,15.81 80.09,25.88 72.26,25.88 v1(72.16,25.78)
JTAG14: length 43.8
  Top Layer w0.229: v1(71.6,21.74) 71.06,21.2 U1.72
  Bottom Layer w0.254: NOREF.1 96.07,13.57 89.26,13.57 80.69,22.14 72,22.14 v1(71.6,21.74)
LED1_1: length 2.4
  Top Layer w0.254: 16.09,26.78 16.09,24.62 POWER.2
LED1_2: length 2.4
  Top Layer w0.254: 21.78,26.78 21.78,24.62 ACT.2
LWR: length 53.4
  Top Layer w0.229: v1(61.69,11.31) 60.35,11.31 59.96,11.7 U1.53
  Bottom Layer w0.229: v1(61.69,11.31) 66.6,16.21 66.6,32.65 68.48,34.53 80.11,34.53 80.87,35.29 80.87,36.76 83.41,39.3 83.41,43.72 83.39,43.75
M3: length 58.2
  Top Layer w0.229: v1(60.86,10.55) 60.22,10.55 59.57,11.2 U1.52
  Bottom Layer w0.229: v1(60.86,10.55) 62.28,10.55 67.13,15.4 67.13,32.29 68.91,34.07 80.31,34.07 81.28,35.04 81.28,36.53 84.02,39.28 84.02,40.9 84.96,41.84 87.86,41.84 88.47,42.45 88.47,43.75
NRST: length 60.7
  Top Layer w0.254: 72.38,12 72.38,7.05 72.44,6.99 ; 74.45,6.99 RESET.4 67.96,6.99 63.4,2.42 38.96,2.42 37.08,4.3 v4(37.08,7.89) ; v4(38.15,15.94) 38.41,16.2 41.57,16.2
  Bottom Layer w0.254: v4(37.08,7.89) 37.08,14.87 v4(38.15,15.94)
S$187162: length 24.4
  Top Layer w0.254: 41.57,19.7 38.83,19.7 37.26,21.27 37.26,22.13 36.09,23.3 20.47,23.3 20.19,23.58 20.23,23.62 ACT.1
S$187734: length 20.4
  Top Layer w0.229: R4.1 76.28,20.64 58.03,20.64 57.97,20.7 U1.71
S$187738: length 20.4
  Top Layer w0.229: 56.72,20.2 57.97,20.2 58.03,20.26 76.3,20.26 76.3,20.25 R5.1
TIME: length 61.3
  Top Layer w0.229: U1.51 58.93,10.7 v1(59.81,9.81)
  Bottom Layer w0.229: v1(59.81,9.81) 62.46,9.81 67.66,15.02 67.66,31.94 69.36,33.64 80.51,33.64 81.73,34.86 81.73,36.31 84.53,39.1 84.53,40.52 85.19,41.18 90.09,41.18 91.03,42.12 91.03,43.72 91.01,43.75
USB1_A6: length 22.4
  Top Layer w0.229: USB1.A6 85.37,15.23 79.96,20.64 ; R6.1 79.96,21.79 79.96,20.64 ; 79.96,20.64 78.91,20.64 R4.2
  Top Layer w0.254: 86.37,7.59 86.37,8.63 86.16,8.84 85.63,8.84 85.37,8.59 85.37,7.59
USB1_A7: length 19.9
  Top Layer w0.229: R5.2 78.91,20.26 79.8,20.26 84.87,15.19 USB1.B7
  Top Layer w0.254: 84.87,7.59 84.87,6.51 85.09,6.29 85.62,6.29 85.87,6.55 85.87,7.59
VCLK: length 53.1
  Top Layer w0.229: 45.65,24.27 45.65,21.42 v1(46.15,20.91)
  Bottom Layer w0.229: 60.53,43.75 60.53,36.36 60.73,36.15 60.73,18.88 56.44,14.59 54.3,14.59 53.57,13.85 50.82,13.85 49.65,12.68 47.44,12.68 46.15,13.98 v1(46.15,20.91)
VRES: length 51.1
  Top Layer w0.229: v1(79.5,35.6) 80.85,36.94 80.85,43.75 ; 56.72,12.2 61.1,12.2 v1(61.16,12.25)
  Bottom Layer w0.229: v1(61.16,12.25) 66.06,17.15 66.06,33 68.02,34.96 78.86,34.96 v1(79.5,35.6)
  Bottom Layer w0.254: v1(79.5,35.6) 79.02,35.12
VUSB: length 22.1
  Top Layer w0.5: v4(87.99,9.3) 87.22,10.07 87.22,22.16 F1.2
  Top Layer w0.508: 88.02,7.59 88.02,9.27 v4(87.99,9.3) ; v4(82.78,9.2) 83.22,8.76 83.22,7.59
  Bottom Layer w0.508: v4(82.78,9.2) 82.88,9.3 v4(87.99,9.3)
XTAL+: length 10.8
  Top Layer w0.254: U1.13 35.87,16.7 34.63,15.45 X2.3 33.28,13.53 C2.2
XTAL-: length 13.3
  Top Layer w0.254: 41.57,17.2 34.9,17.2 34.33,16.63 31.96,16.63 31.58,17.01 X2.1 31.23,18 C1.1

## Copper pours and planes (outline as drawn; the poured copper is in the pictures)
GND on Top Layer: -0.21,57.59 108.84,57.59 109.09,0.24 0.78,0.24 -0.21,1.52
GND on Bottom Layer: -0.25,58.4 108.43,56.69 108.43,0.22 0.35,0 -0.25,-0.25

Small or netless copper shapes (teardrops, artwork), in the pictures only: 137 on Top Layer, 56 on Bottom Layer

## Text on the board
Bottom Silkscreen Layer: www.epicjoylab.com | https://github.com/Epicjoy/md_rewriter
Component Marking Layer: 10uF | R-LED | B-LED | AMS1117-3.3
Top Silkscreen Layer: C9 | U2 | F1 | C10 | USB | U1 | V1.0  202506 | CART FRONT | MD Rewriter
